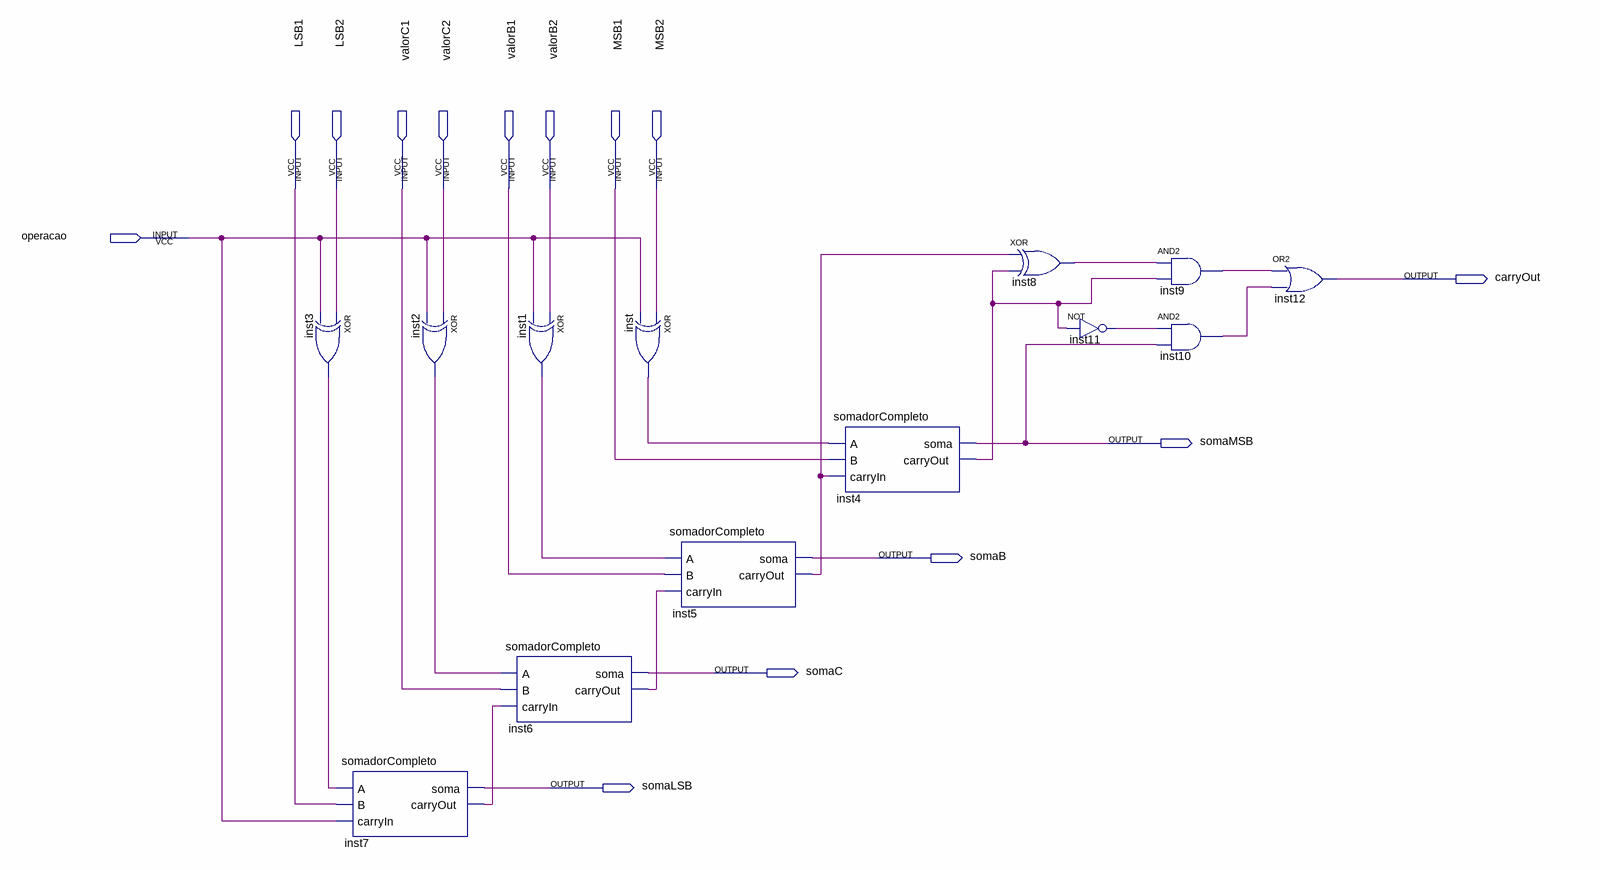
[diagram p0: schematic sheet]
// Quartus schematic somadorSubtrator.bdf as structural Verilog: 13 symbols, 14 pins
module somadorSubtrator (
  input  LSB1,
  input  LSB2,
  input  valorC1,
  input  valorC2,
  input  valorB1,
  input  valorB2,
  input  MSB1,
  input  MSB2,
  input  operacao,
  output carryOut,
  output somaMSB,
  output somaB,
  output somaC,
  output somaLSB
);

  wire inst1_out, inst2_out, inst3_out, inst4_carryout, inst5_carryout, inst6_carryout, inst7_carryout,
       inst8_out, inst9_out, inst10_out, inst11_out, inst_out;

  xor inst3 (inst3_out, LSB2, operacao);
  somadorCompleto inst7 (.A(inst3_out), .B(LSB1), .carryIn(operacao), .soma(somaLSB), .carryOut(inst7_carryout));
  xor inst2 (inst2_out, valorC2, operacao);
  xor inst1 (inst1_out, valorB2, operacao);
  somadorCompleto inst6 (.A(inst2_out), .B(valorC1), .carryIn(inst7_carryout), .soma(somaC), .carryOut(inst6_carryout));
  xor inst (inst_out, MSB2, operacao);
  somadorCompleto inst5 (.A(inst1_out), .B(valorB1), .carryIn(inst6_carryout), .soma(somaB), .carryOut(inst5_carryout));
  somadorCompleto inst4 (.A(inst_out), .B(MSB1), .carryIn(inst5_carryout), .soma(somaMSB), .carryOut(inst4_carryout));
  xor inst8 (inst8_out, inst5_carryout, inst4_carryout);
  not inst11 (inst11_out, inst4_carryout);
  and inst9 (inst9_out, inst8_out, inst4_carryout);
  and inst10 (inst10_out, inst11_out, somaMSB);
  or inst12 (carryOut, inst9_out, inst10_out);
endmodule
